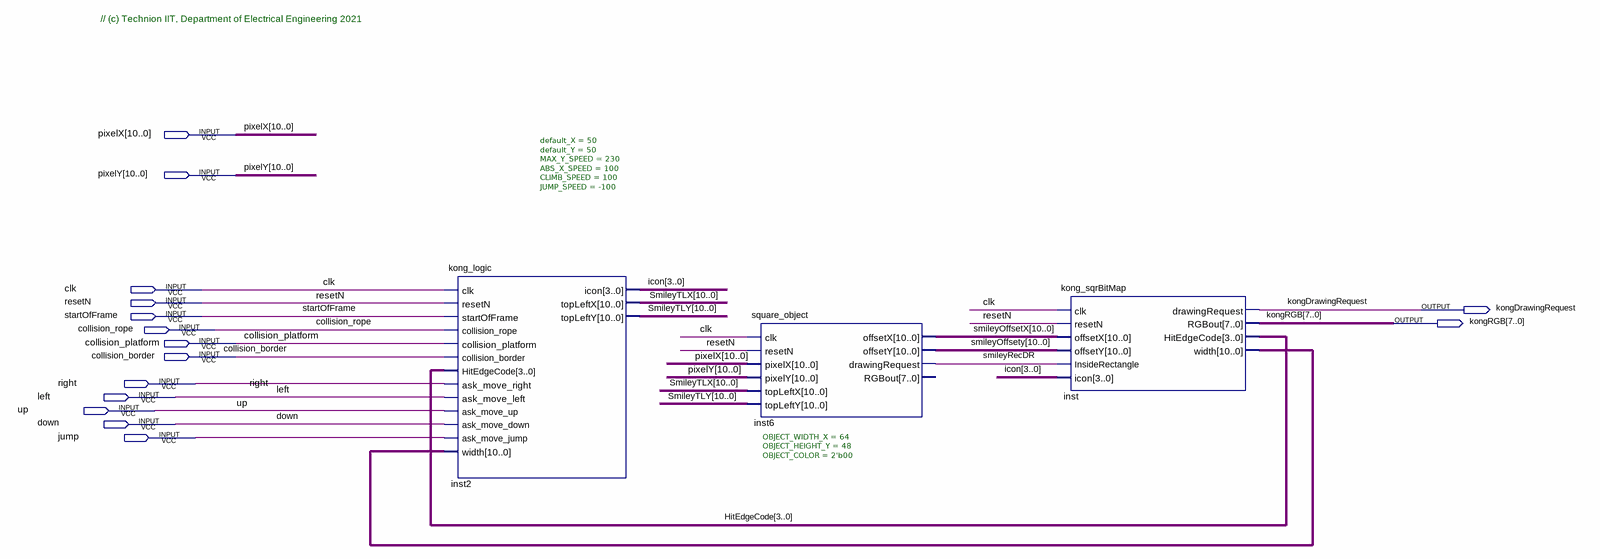
[diagram p0: schematic sheet]
// Quartus schematic Smiley_Block.bdf as structural Verilog: 3 symbols, 15 pins
module Smiley_Block (
  input  [10:0] pixelX,
  input  [10:0] pixelY,
  input  clk,
  input  resetN,
  input  startOfFrame,
  input  collision_rope,
  input  collision_platform,
  input  collision_border,
  input  right,
  input  left,
  input  up,
  input  down,
  input  jump,
  output kongDrawingRequest,
  output [7:0] kongRGB
);

  wire smileyRecDR;
  wire [3:0] HitEdgeCode, icon;
  wire [10:0] inst_width, smileyOffsetX, smileyOffsety, SmileyTLX, SmileyTLY;

  kong_logic #(.default_X(50), .default_Y(50), .MAX_Y_SPEED(230), .ABS_X_SPEED(100), .CLIMB_SPEED(100), .JUMP_SPEED(-100)) inst2 (
    .clk(clk), .resetN(resetN), .startOfFrame(startOfFrame), .collision_rope(collision_rope),
    .collision_platform(collision_platform), .collision_border(collision_border), .HitEdgeCode(HitEdgeCode),
    .ask_move_right(right), .ask_move_left(left), .ask_move_up(up), .ask_move_down(down),
    .ask_move_jump(jump), .width(inst_width), .icon(icon), .topLeftX(SmileyTLX), .topLeftY(SmileyTLY));
  square_object #(.OBJECT_WIDTH_X(64), .OBJECT_HEIGHT_Y(48), .OBJECT_COLOR(2'b00)) inst6 (
    .clk(clk), .resetN(resetN), .pixelX(pixelX), .pixelY(pixelY), .topLeftX(SmileyTLX), .topLeftY(SmileyTLY),
    .offsetX(smileyOffsetX), .offsetY(smileyOffsety), .drawingRequest(smileyRecDR));  // open: RGBout
  kong_sqrBitMap inst (
    .clk(clk), .resetN(resetN), .offsetX(smileyOffsetX), .offsetY(smileyOffsety),
    .InsideRectangle(smileyRecDR), .icon(icon), .drawingRequest(kongDrawingRequest), .RGBout(kongRGB),
    .HitEdgeCode(HitEdgeCode), .width(inst_width));

  // Notes on the sheet:
  //   // (c) Technion IIT, Department of Electrical Engineering 2021
endmodule
